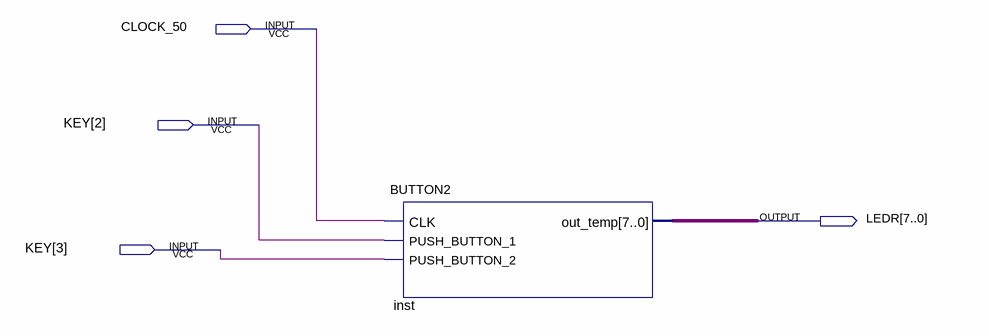
[diagram p0: schematic sheet]
// Quartus schematic BUTTON2_Demo.bdf as structural Verilog: 1 symbols, 4 pins
module BUTTON2_Demo (
  input  CLOCK_50,
  input  [3:2] KEY,
  output [7:0] LEDR
);

  BUTTON2 inst (.CLK(CLOCK_50), .PUSH_BUTTON_1(KEY[2]), .PUSH_BUTTON_2(KEY[3]), .out_temp(LEDR));
endmodule
